# EAGLE design rasbperryPI (EAGLE 8.3.1)
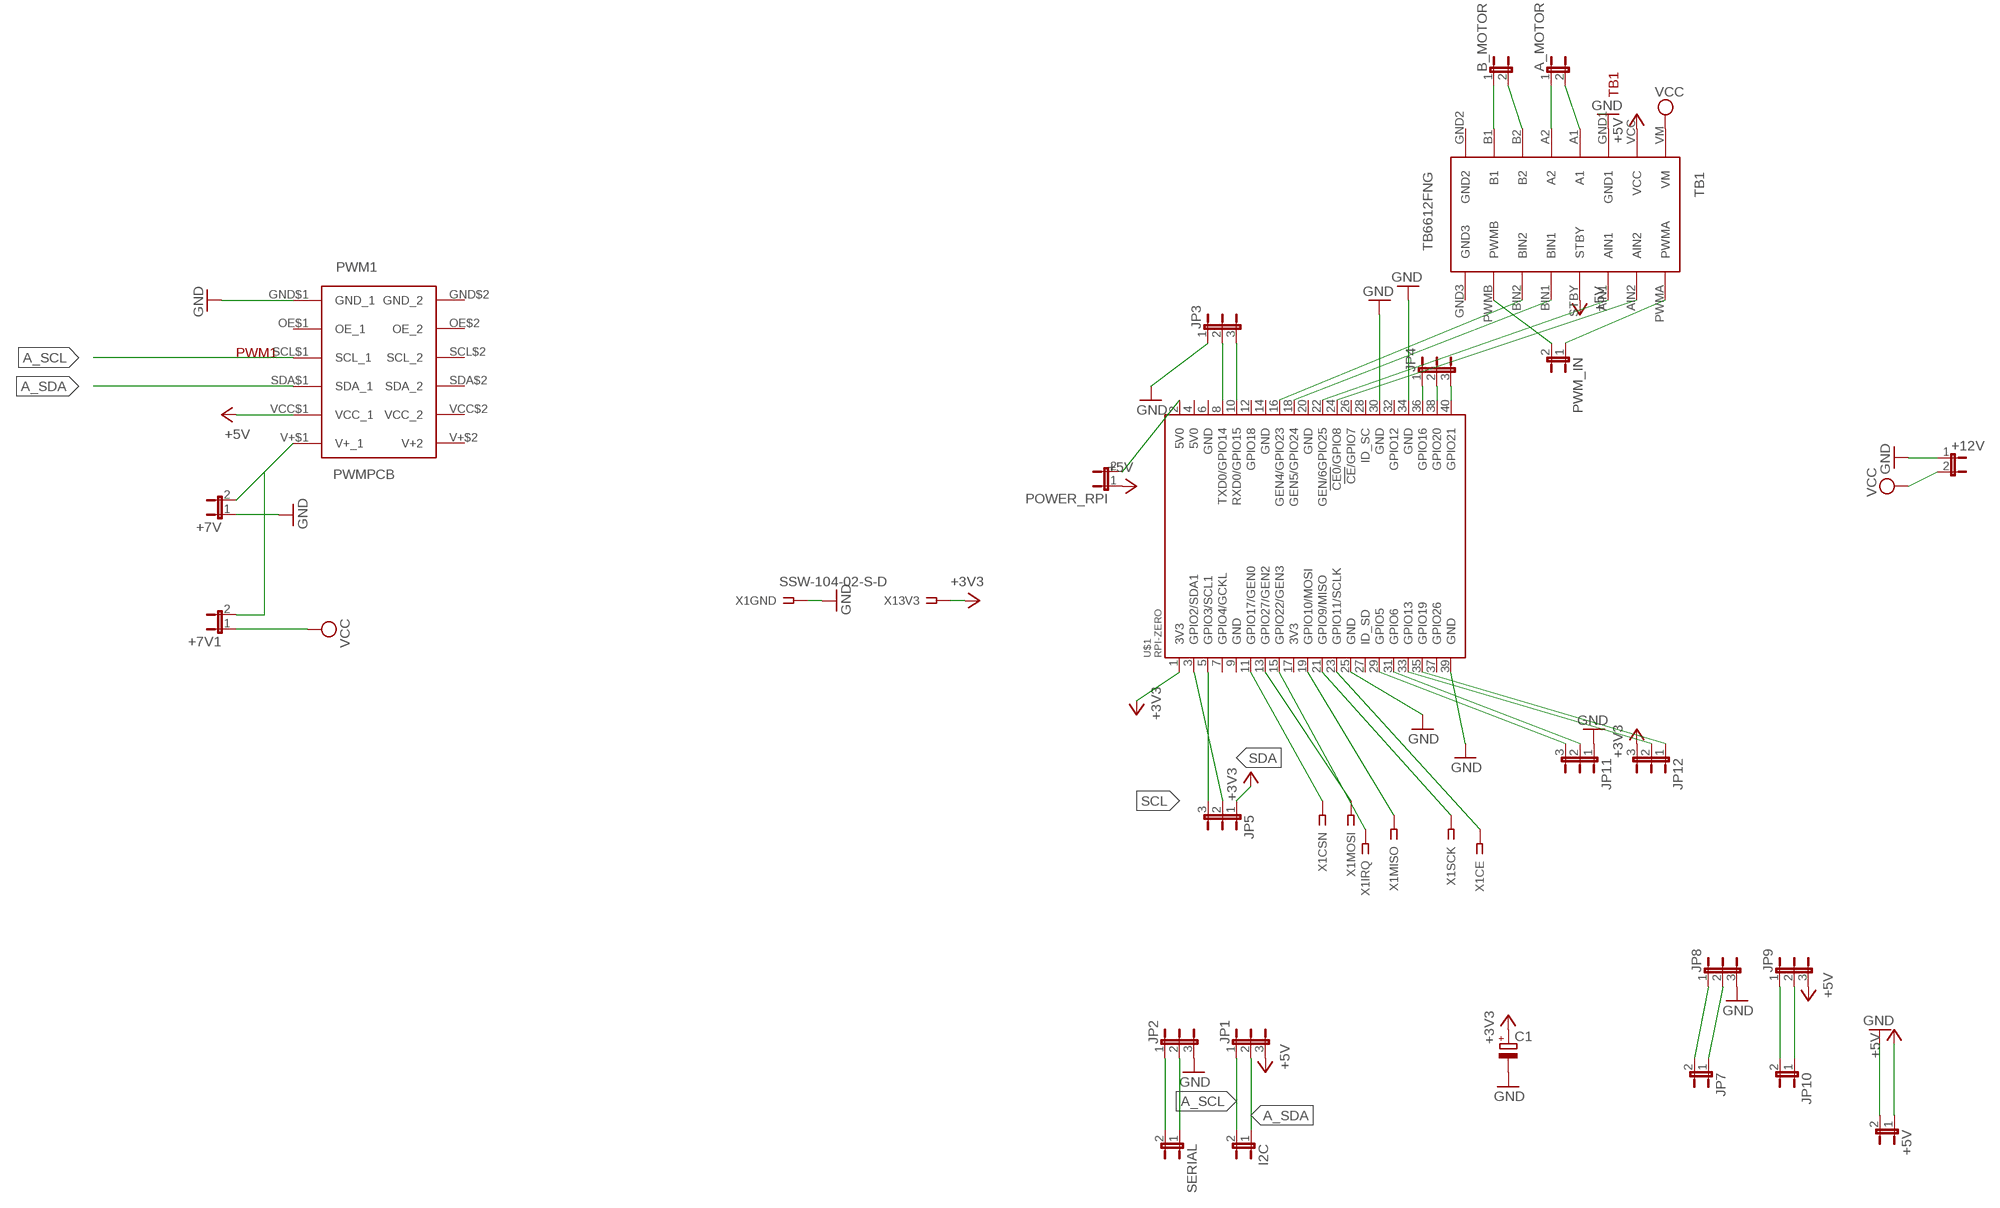
[diagram p0: schematic, sheet 1]

## Parts
+5V  JP1E  [JP1]
+7V  JP1E  [JP1]
+7V1  JP1E  [JP1]
+12V  JP1E  [JP1]
A_MOTOR  JP1E  [JP1]
B_MOTOR  JP1E  [JP1]
C1  CPOL-EUE2,5-6E  [E2,5-6E]
I2C  JP1E  [JP1]
JP1  JP2E  [JP2]
JP2  JP2E  [JP2]
JP3  JP2E  [JP2]
JP4  JP2E  [JP2]
JP5  JP2E  [JP2]
JP7  JP1E  [JP1]
JP8  JP2E  [JP2]
JP9  JP2E  [JP2]
JP10  JP1E  [JP1]
JP11  JP2E  [JP2]
JP12  JP2E  [JP2]
POWER_RPI  JP1E  [JP1]
PWM1  PWMPCB  [PWM]
PWM_IN  JP1E  [JP1]
SERIAL  JP1E  [JP1]
TB1  TB6612FNG  [TB6612FNG]
U$1  RPI-ZERO  [RASP_PI_ZERO_BOARD_FULL]
X1  SSW-104-02-S-D  [SSW-104-02-S-D]

## Nets
5V0@1: POWER_RPI.2 U$1.2(5V0)
+3V3: C1.+ JP5.1 JP12.3 U$1.1(3V3) X1.2
+5V: +5V.1 JP1.3 JP9.3 POWER_RPI.1 PWM1.VCC$1(VCC_1) TB1.STBY TB1.VCC
A_SCL: I2C.2 JP1.1 PWM1.SCL$1(SCL_1)
A_SDA: I2C.1 JP1.2 PWM1.SDA$1(SDA_1)
GND: +5V.2 +7V.1 +12V.1 C1.- JP2.3 JP3.1 JP8.3 JP11.1 PWM1.GND$1(GND_1) TB1.GND1 U$1.25(GND) U$1.30(GND) U$1.34(GND) U$1.39(GND) X1.1
N$1: +7V1.2 +7V.2 PWM1.V+$1(V+_1)
N$2: JP4.1 U$1.36(GPIO16)
N$3: U$1.11(GPIO17/GEN0) X1.4
N$4: U$1.13(GPIO27/GEN2) X1.6
N$5: U$1.15(GPIO22/GEN3) X1.8
N$6: U$1.19(GPIO10/MOSI) X1.7
N$7: U$1.21(GPIO9/MISO) X1.5
N$8: U$1.23(GPIO11/SCLK) X1.3
N$9: JP11.3 U$1.29(GPIO5)
N$10: JP11.2 U$1.31(GPIO6)
N$11: PWM_IN.1 TB1.PWMA
N$12: PWM_IN.2 TB1.PWMB
N$13: JP12.2 U$1.33(GPIO13)
N$14: JP12.1 U$1.35(GPIO19)
N$15: JP3.3 U$1.10(RXD0/GPIO15)
N$16: JP3.2 U$1.8(TXD0/GPIO14)
N$17: B_MOTOR.1 TB1.B1
N$18: B_MOTOR.2 TB1.B2
N$19: A_MOTOR.1 TB1.A2
N$20: A_MOTOR.2 TB1.A1
N$21: JP2.1 SERIAL.2
N$22: JP2.2 SERIAL.1
N$23: TB1.BIN2 U$1.16(GEN4/GPIO23)
N$24: TB1.BIN1 U$1.18(GEN5/GPIO24)
N$25: TB1.AIN1 U$1.22(GEN/6GPIO25)
N$26: TB1.AIN2 U$1.24(!CE0!/GPIO8)
N$27: JP7.2 JP8.1
N$28: JP7.1 JP8.2
N$29: JP9.1 JP10.2
N$30: JP9.2 JP10.1
N$31: JP4.2 U$1.38(GPIO20)
N$34: JP4.3 U$1.40(GPIO21)
SCL: JP5.3 U$1.5(GPIO3/SCL1)
SDA: JP5.2 U$1.3(GPIO2/SDA1)
VCC: +7V1.1 +12V.2 TB1.VM
Unconnected: PWM1.GND$2(GND_2) PWM1.OE$1(OE_1) PWM1.OE$2(OE_2) PWM1.SCL$2(SCL_2) PWM1.SDA$2(SDA_2) PWM1.V+$2(V+2) PWM1.VCC$2(VCC_2) TB1.GND2 TB1.GND3 U$1.4(5V0) U$1.6(GND) U$1.7(GPIO4/GCKL) U$1.9(GND) U$1.12(GPIO18) U$1.14(GND) U$1.17(3V3) U$1.20(GND) U$1.26(!CE!/GPIO7) U$1.27(ID_SD) U$1.28(ID_SC) U$1.32(GPIO12) U$1.37(GPIO26)

## Library data of the parts
+5V +7V +7V1 +12V A_MOTOR B_MOTOR I2C JP7 JP10 POWER_RPI PWM_IN SERIAL = jumper:JP1E: JUMPER
C1 = rcl:CPOL-EU: POLARIZED CAPACITOR, European symbol
JP1-JP5 JP8 JP9 JP11 JP12 = jumper:JP2E: JUMPER
PWM1 = PWM_I2C:PWM: PWM I2C
TB1 = TB6612FNG:TB6612FNG
U$1 = RPI-Zero:RPI-ZERO
X1 = Sajdak:SSW-104-02-S-D: THROUGH-HOLE .025" SQ POST SOCKET Source: Samtec SSW.pdf; NRF24L01: nrf24l01; OC_FARNELL: 1668346; OC_NEWARK: 11P9382

## Board
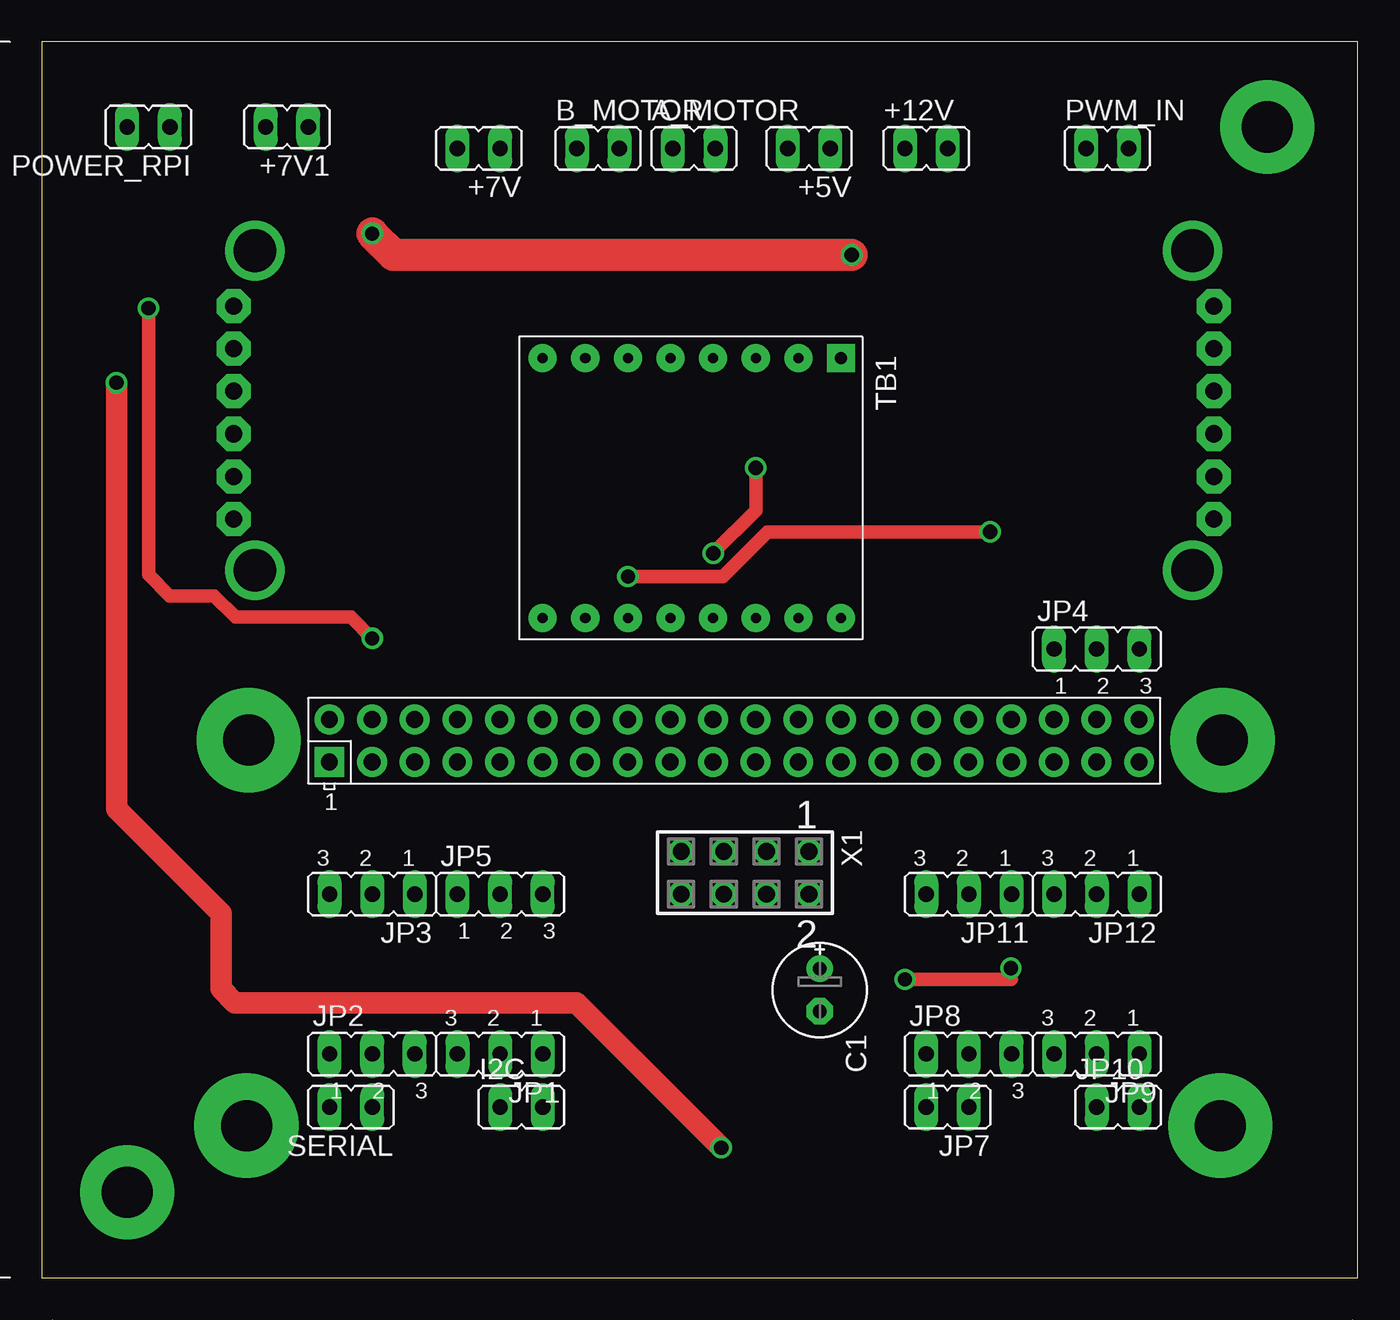
[diagram p1: board, top side]
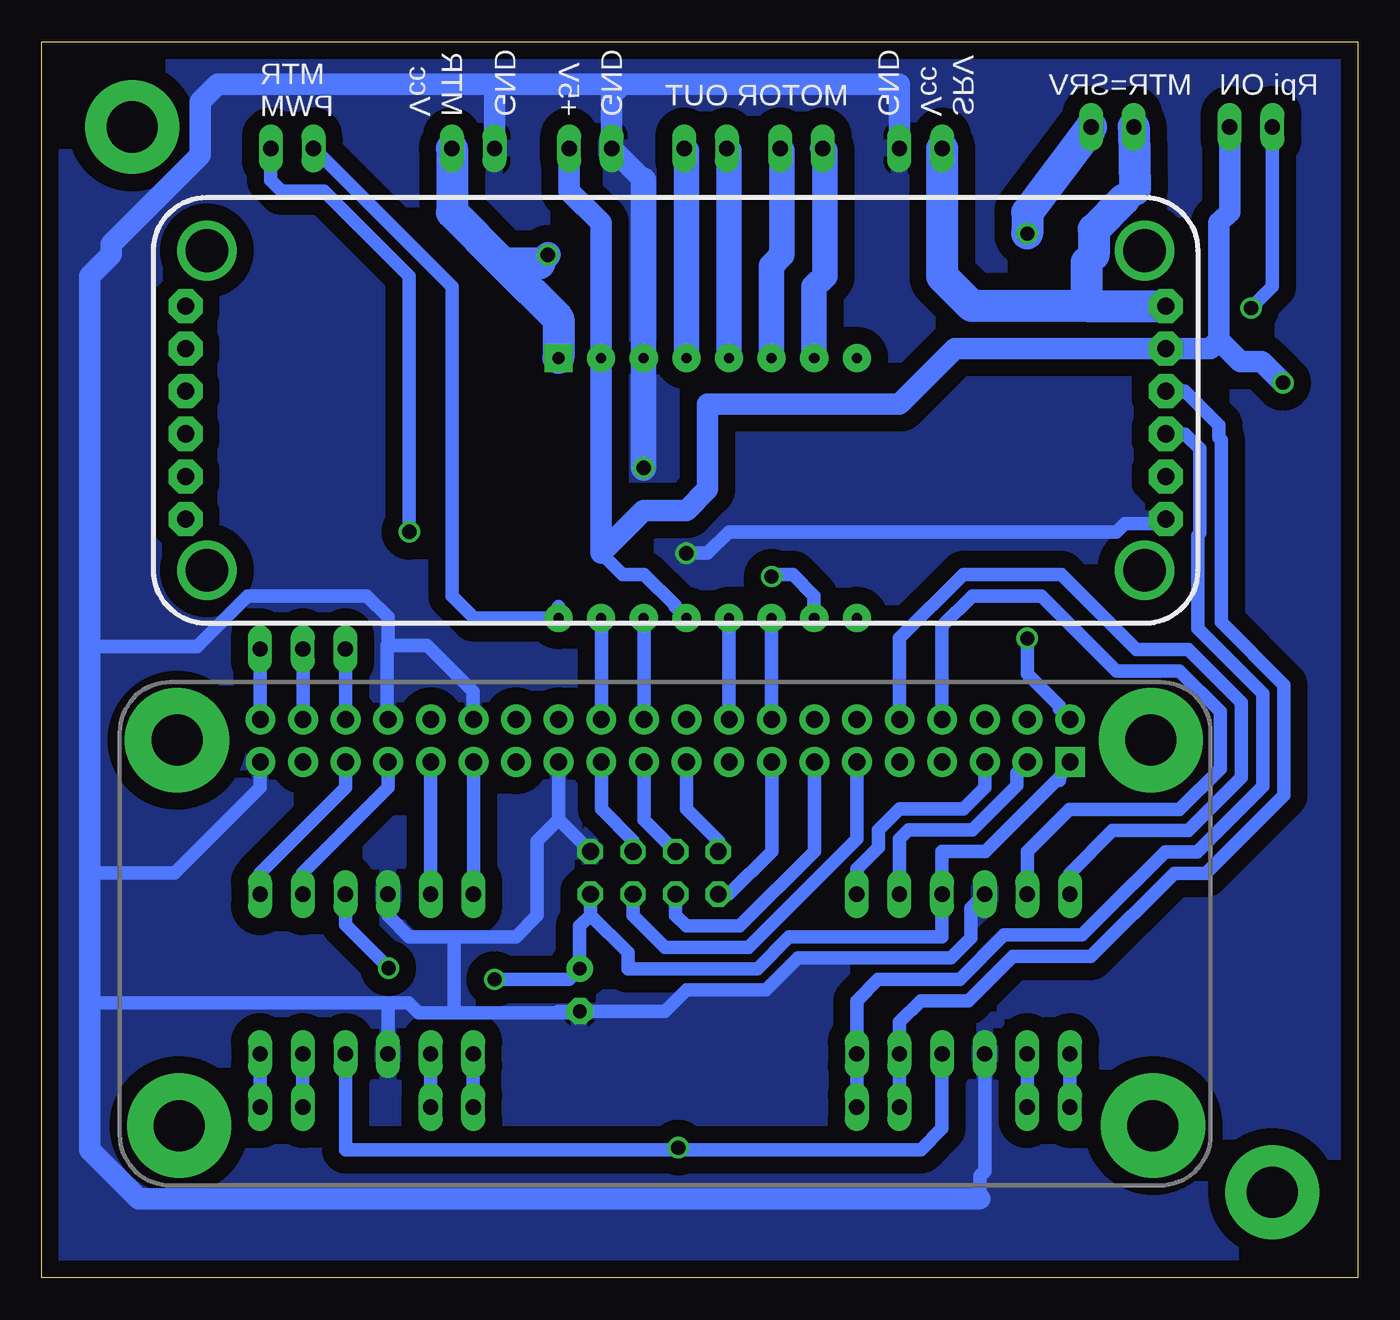
[diagram p2: board, bottom side, seen from below]

Size 78.41 x 73.65 mm. Coordinates in mm from the lower left corner, seen from the top.
Outline: 0,0 78.41,0 78.41,73.65 0,73.65 0,0
Copper layers (1*16): Top 0.035mm / dielectric 1.5mm / Bottom 0.035mm
Design rules "default *": minimum track width 6mil, minimum drill 0.4mm, track to track 18mil, track to pad 24mil, pad to pad 24mil, via to via 24mil, smd to smd 18mil, copper to edge 6mil, drill to drill 6mil, minimum pad ring 10mil, minimum via ring 8mil, stop-mask expansion 4mil, vias tented up to drill 0mil, thermal gap 10mil

### Footprints (pad centres in the part's own frame; a part is rotated, then mirrored left to right if it is on the bottom)
JP1 = drill 0.914 long: 1 0,-1.27; 2 0,1.27
E2,5-6E = drill 0.813 pad 1.575: + -1.27,0 | drill 0.813 pad 1.575 octagon: - 1.27,0
JP2 = drill 0.914 long: 1 -2.54,0; 2 0,0; 3 2.54,0
PWM = drill 1.016 pad 2.032 octagon: GND$1 -24.765,5.588; GND$2 33.655,5.588; OE$1 -24.765,3.048; OE$2 33.655,3.048; SCL$1 -24.765,0.508; SCL$2 33.655,0.508; SDA$1 -24.765,-2.032; SDA$2 33.655,-2.032; V+$1 -24.765,-7.112; V+$2 33.655,-7.112; VCC$1 -24.765,-4.572; VCC$2 33.655,-4.572 | drill 2.54 pad 3.302: P$2 -23.495,8.636; P$3 -23.495,-10.414; P$4 32.385,-10.414; P$5 32.385,8.636
TB6612FNG = drill 0.6 pad 1.676: A1 -7.62,-1.27; A2 -7.62,-3.81; AIN1 7.874,1.27; AIN2 7.874,3.81; B1 -7.62,-8.89; B2 -7.62,-6.35; BIN1 7.874,-3.81; BIN2 7.874,-6.35; GND1 -7.62,1.27; GND2 -7.62,-11.43; GND3 7.874,-11.43; PWMA 7.874,6.35; PWMB 7.874,-8.89; STBY 7.874,-1.27; VCC -7.62,3.81 | drill 0.7 pad 1.676 square: VM -7.62,6.35
RASP_PI_ZERO_BOARD_FULL = drill 1 pad 1.778 square: 1 10.148,25.357 | drill 1 pad 1.778: 2 10.148,27.897; 3 12.688,25.357; 4 12.688,27.897; 5 15.228,25.357; 6 15.228,27.897; 7 17.768,25.357; 8 17.768,27.897; 9 20.308,25.357; 10 20.308,27.897; 11 22.848,25.357; 12 22.848,27.897; 13 25.388,25.357; 14 25.388,27.897; 15 27.928,25.357; 16 27.928,27.897; 17 30.468,25.357; 18 30.468,27.897; 19 33.008,25.357; 20 33.008,27.897; 21 35.548,25.357; 22 35.548,27.897; 23 38.088,25.357; 24 38.088,27.897; 25 40.628,25.357; 26 40.628,27.897; 27 43.168,25.357; 28 43.168,27.897; 29 45.708,25.357; 30 45.708,27.897; 31 48.248,25.357; 32 48.248,27.897; 33 50.788,25.357; 34 50.788,27.897; 35 53.328,25.357; 36 53.328,27.897; 37 55.868,25.357; 38 55.868,27.897; 39 58.408,25.357; 40 58.408,27.897 | drill 3.048 pad 6.223: P$1 5.334,26.67; P$2 5.207,3.683; P$3 63.373,26.67; P$4 63.246,3.683
SSW-104-02-S-D = drill 1 pad 1.5 octagon: 1 -3.81,-1.27; 2 -3.81,1.27; 3 -1.27,-1.27; 4 -1.27,1.27; 5 1.27,-1.27; 6 1.27,1.27; 7 3.81,-1.27; 8 3.81,1.27

### Placement (x,y rotation side)
+5V  45.72,67.31 90 top
+7V  26.04,67.31 90 top
+7V1  14.6,68.58 90 top
+12V  52.7,67.31 270 top
A_MOTOR  38.86,67.31 270 top
B_MOTOR  33.15,67.31 270 top
C1  46.36,17.14 270 top
I2C  28.58,10.16 270 top
JP1  27.3,13.33 180 top
JP2  19.69,13.33 0 top
JP3  19.69,22.86 180 top
JP4  62.87,37.47 0 top
JP5  27.3,22.86 0 top
JP7  53.98,10.16 90 top
JP8  55.24,13.33 0 top
JP9  62.87,13.33 180 top
JP10  64.13,10.16 270 top
JP11  55.24,22.86 180 top
JP12  62.87,22.86 180 top
POWER_RPI  6.35,68.58 90 top
PWM1  36.2,50.8 180 bottom
PWM_IN  63.5,67.31 270 top
SERIAL  18.41,10.16 90 top
TB1  41.27,47.19 270 top
U$1  6.99,5.37 0 top
X1  41.91,24.13 180 top

### Tracks (layer width: path | path; a pad name or v marks a point on that pad's centre or on a via)
5V0@1  (via drill 0.85)
  Top 0.813: v19.69,38.1 18.41,39.37 11.54,39.37 10.27,40.64 7.62,40.64 6.35,41.91 v6.35,57.78
  Bottom 0.813: U$1.2 17.77,33.91 17.77,34.06 19.69,35.98 v19.69,38.1 | v6.35,57.78 5.08,59.05 POWER_RPI.2
+3V3  (via drill 0.85)
  Top 0.813: v51.44,17.78 57.79,17.78 57.75,17.81 v57.75,18.45
  Bottom 0.813: X1.2 45.72,21.6 | 45.72,21.6 43.49,19.37 43.49,18.41 43.49,18.42 35.78,18.42 33.87,20.32 24.77,20.32 JP5.1 24.77,25.4 22.17,25.4 17.77,29.8 | U$1.1 17.77,29.8 | 17.77,29.8 17.77,29.65 | 45.72,21.6 46.36,20.96 C1.+ 46.99,17.78 v51.44,17.78 | v57.75,18.45 60.32,21.02 JP12.3
+5V  (via drill 0.85)
  Top 1.27: v40.49,7.74 31.85,16.39 11.49,16.39 10.67,17.2 10.67,21.71 4.45,27.94 v4.45,53.34
  Bottom 0.813: 60.45,13.46 JP9.3 60.32,7.62 40.37,7.62 | 45.09,43.18 43.82,41.91 42.51,41.91 40.69,40.09 40.69,40 TB1.STBY | 40.37,7.62 26.04,7.62 24.77,8.89 JP1.3 | v40.49,7.74 40.37,7.62
  Bottom 1.27: v4.45,53.34 5.71,54.61 6.99,54.61 8.26,55.88 | POWER_RPI.1 7.62,63.5 8.26,62.86 8.26,55.88 | 8.26,55.88 8.76,55.37 PWM1.VCC$1 24,55.37 27.3,52.07 38.73,52.07 38.73,46.99 40.01,45.72 42.55,45.72 45.09,43.18 TB1.VCC 45.09,62.86 46.99,64.77 +5V.1
A_SCL
  Bottom 0.813: PWM1.SCL$1 10.29,50.29 9.4,49.4 9.4,44.37 9.53,44.24 9.53,38.68 5.65,34.81 5.65,29.28 9.56,25.38 11.46,25.38 13.33,23.5 13.36,23.5 16.43,20.42 21.07,20.42 23.71,17.78 28.58,17.78 29.84,16.51 JP1.1 I2C.2
A_SDA
  Bottom 0.813: PWM1.SDA$1 10.29,52.83 8.26,50.8 8.26,50.06 8.13,49.93 8.13,39.08 4.38,35.33 4.38,28.75 9.03,24.11 10.93,24.11 15.88,19.15 20.55,19.15 23.19,16.51 26.04,16.51 27.3,15.24 JP1.2 I2C.1
GND  (via drill 0.85)
  Top 0.813: v40.01,43.18 42.55,45.72 v42.55,48.26
  Bottom 0.813: U$1.25 47.62,30.43 47.62,27.31 | 47.62,27.31 X1.1 | 47.62,27.31 48.9,26.04 48.9,21.59 50.16,20.32 53.98,20.32 | 53.98,20.32 56.52,20.32 57.79,21.59 JP11.1 | PWM1.GND$1 11.68,44.96 13.86,44.96 14.37,44.45 37.47,44.45 38.73,43.18 v40.01,43.18 | JP3.1 23.04,22.05 23.04,20.25 24.24,19.05 33.35,19.05 35.25,17.14 40.01,17.14 41.27,15.88 C1.- | C1.- 47.62,15.88 | C1.- 46.46,15.77 53.83,15.77 | 53.83,15.77 55.96,15.77 56.56,16.38 57.78,16.38 | 53.98,20.32 53.83,20.18 53.83,15.77 | JP2.3 22.23,6.35 22.51,6.07 22.51,4.7 | 57.78,16.38 75.56,16.38 | JP8.3 57.78,16.38 | U$1.30 52.7,33.28 52.7,34.92 55.46,37.68 57.79,37.68 | 57.79,37.68 57.83,37.68 57.83,33.33 U$1.34 | U$1.39 65.41,30.72 65.41,29.21 70.48,24.13 75.56,24.13 | 57.79,37.68 57.79,39.37 59.05,40.64 66.15,40.64 69.16,37.63 75.56,37.63
  Bottom 1.27: +7V.1 27.3,71.12 43.82,71.12 | 43.82,71.12 51.44,71.12 | 51.44,71.12 +12V.1 | 43.82,71.12 44.45,70.48 +5V.2 42.55,65.41 | 22.51,4.7 72.64,4.7 75.56,7.62 75.56,16.38 75.56,24.13 75.56,37.63 75.56,59.69 74.29,60.96 74.29,61.6 68.99,66.91 68.99,70.08 67.94,71.12 51.44,71.12
  Bottom 1.524: 42.55,65.41 TB1.GND1 v42.55,48.26
  pour Bottom (isolate 1.016): 102.23,78.74 -14.61,92.71 -10.79,-12.7 102.23,-12.7
N$1
  Bottom 1.27: 15.72,60.96 16.16,60.52
  Bottom 1.524: 13.28,64.82 13.92,64.27
  Bottom 1.905: +7V.2 24.77,59.69 22.99,57.91 16.16,57.91 | 16.16,57.91 PWM1.V+$1 | +7V1.2 13.28,64.82 | 15.72,60.96 15.72,62.47 13.92,64.27 | 16.16,60.52 16.16,57.91
N$2
  Bottom 0.813: JP4.1 60.31,37.45 U$1.36
N$3
  Bottom 0.813: U$1.11 29.83,26.16 36.3,19.68 41.27,19.68 43.18,21.59 X1.4
N$4
  Bottom 0.813: U$1.13 32.37,25.41 36.83,20.96 40.01,20.96 40.64,21.59 X1.6
N$5
  Bottom 0.813: U$1.15 34.91,25.41 37.47,22.86 X1.8
N$6
  Bottom 0.813: U$1.19 39.99,27.93 38.1,26.04 X1.7
N$7
  Bottom 0.813: U$1.21 42.53,27.29 X1.5
N$8
  Bottom 0.813: U$1.23 45.07,27.93 43.18,26.04 X1.3
N$9
  Bottom 0.813: U$1.29 52.69,22.87 JP11.3
N$10
  Bottom 0.813: U$1.31 55.23,22.87 JP11.2
N$11
  Bottom 0.813: 47.62,40 TB1.PWMA 52.65,39.32 53.98,40.64 53.98,59.05 PWM_IN.1
N$12  (via drill 0.85)
  Top 0.813: v34.93,41.79 40.58,41.79 43.25,44.45 v56.52,44.45
  Bottom 0.813: TB1.PWMB 32.38,40.64 33.66,41.91 34.93,41.91 v34.93,41.79 | v56.52,44.45 56.52,59.69 61.6,64.77 64.13,64.77 64.77,65.41 PWM_IN.2
N$13
  Bottom 0.813: U$1.33 57.77,29.22 62.87,24.13 JP12.2
N$14
  Bottom 0.813: U$1.35 60.31,29.22 65.41,24.13 JP12.1
N$15
  Bottom 0.813: U$1.10 27.29,38.11 23.5,41.91 17.67,41.91 13.2,37.44 10.08,37.44 6.92,34.28 6.92,29.81 10.08,26.64 14.6,26.64 17.15,24.11 JP3.3
N$16
  Bottom 0.813: U$1.8 24.75,33.03 24.77,33.02 24.77,38.84 22.97,40.64 18.84,40.64 14.37,36.17 10.61,36.17 8.19,33.75 8.19,30.33 10.61,27.92 17.17,27.92 19.69,25.4 JP3.2
N$17
  Bottom 1.524: B_MOTOR.1 31.75,67.18 31.75,59.69 32.38,59.05 TB1.B1
N$18
  Bottom 1.27: B_MOTOR.2 34.29,67.18
  Bottom 1.524: TB1.B2 34.93,60.33 34.29,60.96 34.29,67.18
N$19
  Bottom 1.27: A_MOTOR.1 37.47,67.18
  Bottom 1.524: 37.47,67.18 TB1.A2
N$20
  Bottom 1.27: A_MOTOR.2 40.01,67.18
  Bottom 1.524: 40.01,67.18 TB1.A1
N$21
  Bottom 0.813: JP2.1 SERIAL.2
N$22
  Bottom 0.813: JP2.2 SERIAL.1
N$23
  Bottom 0.813: TB1.BIN2 34.93,33.02 34.91,33.01 U$1.16
N$24
  Bottom 0.813: TB1.BIN1 37.45,39.31 U$1.18
N$25
  Bottom 0.813: TB1.AIN1 42.53,39.31 U$1.22
N$26
  Bottom 0.813: TB1.AIN2 45.07,39.31 U$1.24
N$27
  Bottom 0.813: JP8.1 JP7.2
N$28
  Bottom 0.813: JP8.2 JP7.1
N$29
  Bottom 0.813: JP9.1 JP10.2
N$30
  Bottom 0.813: JP9.2 JP10.1
N$31
  Bottom 0.813: JP4.2 62.85,37.45 U$1.38
N$32  (via drill 3.05 pad 5.59)
  other vias: 5.08,5.08
N$33  (via drill 3.05 pad 5.59)
  other vias: 73.02,68.58
N$34
  Bottom 0.813: JP4.3 65.39,37.45 U$1.40
SCL
  Bottom 0.813: U$1.5 22.23,30.72 22.23,29.21 23.5,27.94 27.3,27.94 28.56,26.68 28.56,25.63 29.84,24.35 JP5.3
SDA
  Bottom 0.813: U$1.3 20.31,30.1 20.31,29.33 22.97,26.67 26.78,26.67 27.29,26.16 27.29,25.1 27.3,25.09 JP5.2
VCC  (via drill 0.85)
  Top 1.905: v19.69,62.23 20.95,60.96 v48.26,60.96
  Bottom 1.524: v48.26,60.96 48.77,60.45
  Bottom 1.905: +12V.2 53.98,63.5 50.92,60.45 | 50.92,60.45 47.62,57.15 TB1.VM | +7V1.1 19.69,63.5 v19.69,62.23 | 48.77,60.45 50.92,60.45

### Text on the board
bPlace: MTR / PWM | Rpi ON | MTR=SRV | MOTOR OUT | SRV / Vcc | GND | GND | +5V | GND | MTR / Vcc
bOrigins: RpiShileld / v2.0 | RemoteMe.org